# Altium schematic sheet relflow_bed.SchDoc
size A3
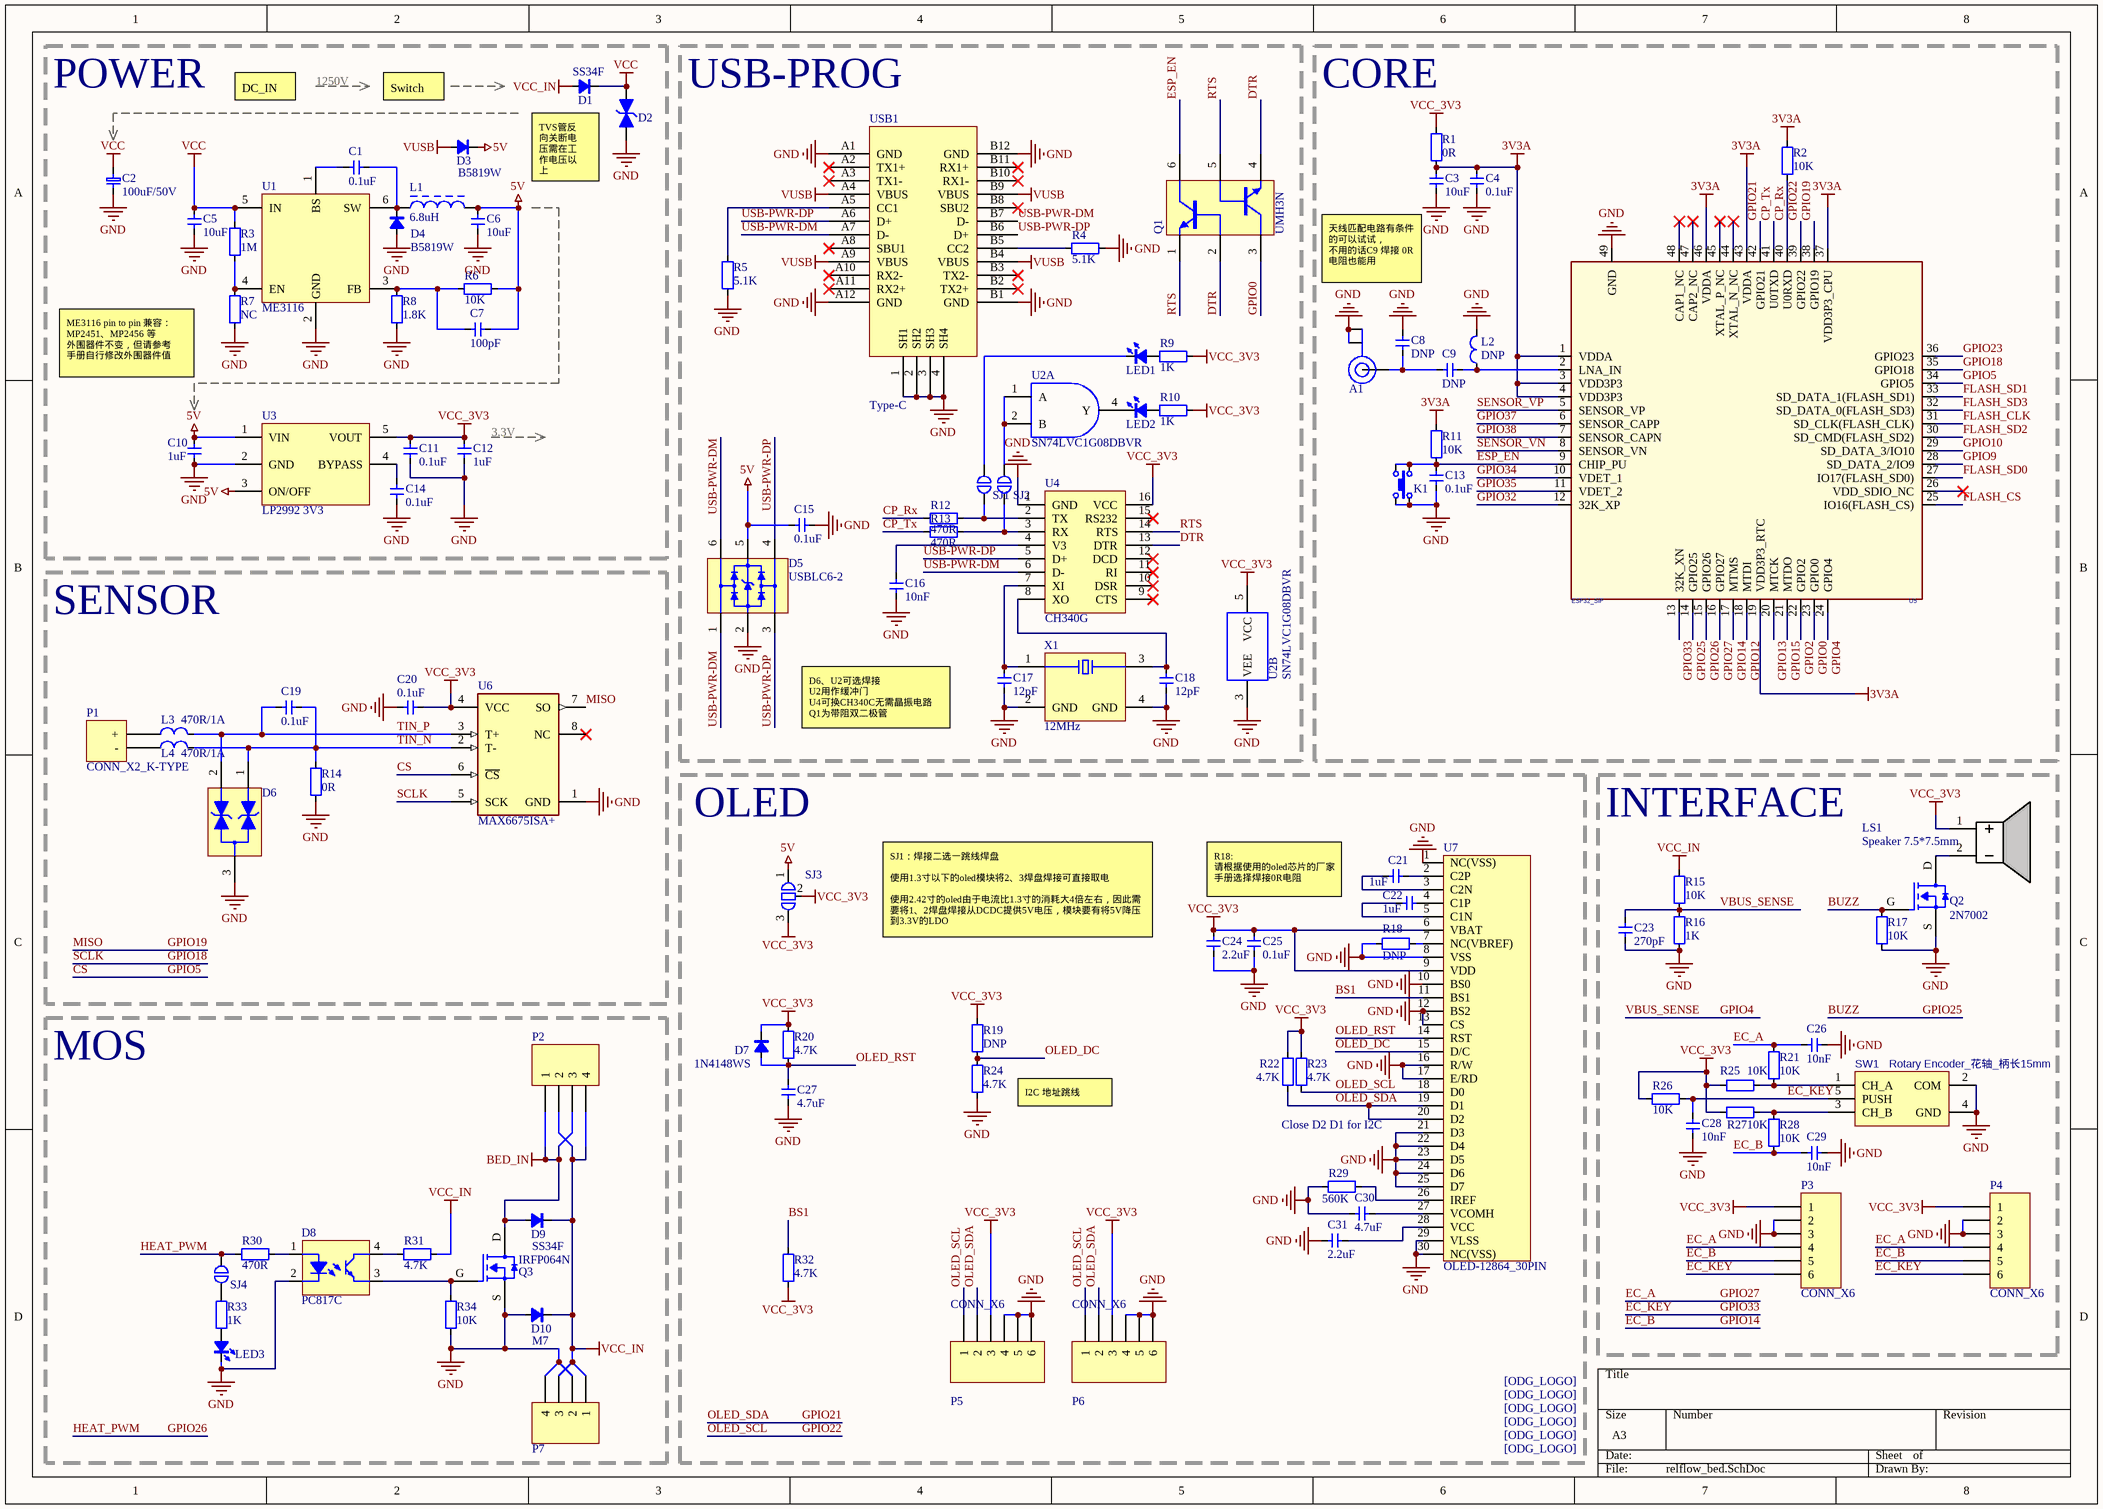
[diagram p0: relflow_bed.SchDoc]

## Parts
*1  odg_logo  [odg_logo]  (value not drawn)
*2  odg_logo  [odg_logo]  (value not drawn)
*3  odg_logo  [odg_logo]  (value not drawn)
*4  odg_logo  [odg_logo]  (value not drawn)
*5  odg_logo  [odg_logo]  (value not drawn)
*6  odg_logo  [odg_logo]  (value not drawn)
A1  ANT_IPEX  [IPEX_SMD]  (value not drawn)
C1  0.1uF  [C0603]
C2  100uF/50V  [PANASONIC_E]
C3  10uF  [C0603]
C4  0.1uF  [C0603]
C5  10uF  [C1206]
C6  10uF  [C0805]
C7  100pF  [C0603]
C8  DNP  [C0603]
C9  DNP  [C0603]
C10  1uF  [C0603]
C11  0.1uF  [C0603]
C12  1uF  [C0603]
C13  0.1uF  [C0603]
C14  0.1uF  [C0603]
C15  0.1uF  [C0603]
C16  10nF  [C0603]
C17  12pF  [C0603]
C18  12pF  [C0603]
C19  0.1uF  [C0603]
C20  0.1uF  [C0603]
C21  1uF  [C0603]
C22  1uF  [C0603]
C23  270pF  [C0603]
C24  2.2uF  [C0603]
C25  0.1uF  [C0603]
C26  10nF  [C0603]
C27  4.7uF  [C0603]
C28  10nF  [C0603]
C29  10nF  [C0603]
C30  4.7uF  [C0603]
C31  2.2uF  [C0603]
D1  SS34F  [SMAF]
D2  TVS_Bi  [DO-214AA_SMBJ]  (value not drawn)
D3  B5819W  [SOD-123]
D4  B5819W  [SOD-123]
D5  USBLC6-2  [MICROCHIP SOT-23-6 M6]
D6  NUP2105L  [INFINEON SOT-23-3]  (value not drawn)
D7  1N4148WS  [SOD-323]
D8  PC817C  [DIP-4_SMD]
D9  SS34F  [SMAF]
D10  M7  [SMAF]
K1  (no value)  [TACTILE_SWITCH_SMD_4X4MM]
L1  6.8uH  [IND-30301X]
L2  DNP  [L0603]
L3  470R/1A  [L0603]
L4  470R/1A  [L0603]
LED1  LED  [LED 0603_1608]  (value not drawn)
LED2  LED  [LED 0603_1608]  (value not drawn)
LED3  LED  [LED 0603_1608]  (value not drawn)
LS1  Speaker 7.5*7.5mm  [BUZZER_7525]
P1  CONN_X2_K-TYPE  [K型热电偶连接器母座]
P2  CONN_X4  [5569_4P_HOR_90]  (value not drawn)
P3  CONN_X6  [简易牛角座直插_2x3P]
P4  CONN_X6  [简易牛角座直插_2x3P]
P5  CONN_X6  [简易牛角座直插_2x3P]
P6  CONN_X6  [简易牛角座直插_2x3P]
P7  CONN_X4  [5566_4P_VEC]  (value not drawn)
Q1  UMH3N  [ON SEMI SOT-363]
Q2  2N7002  [INFINEON SOT-23-3]
Q3  IRFP064N  [TO-247AC+HEAT_SINK-TO220]
R1  0R  [R0603]
R2  10K  [R0603]
R3  1M  [R0603]
R4  5.1K  [R0603]
R5  5.1K  [R0603]
R6  10K  [R0603]
R7  NC  [R0603]
R8  1.8K  [R0603]
R9  1K  [R0603]
R10  1K  [R0603]
R11  10K  [R0603]
R12  470R  [R0603]
R13  470R  [R0603]
R14  0R  [R0603]
R15  10K  [R0603]
R16  1K  [R0603]
R17  10K  [R0603]
R18  DNP  [R0603]
R19  DNP  [R0603]
R20  4.7K  [R0603]
R21  10K  [R0603]
R22  4.7K  [R0603]
R23  4.7K  [R0603]
R24  4.7K  [R0603]
R25  10K  [R0603]
R26  10K  [R0603]
R27  10K  [R0603]
R28  10K  [R0603]
R29  560K  [R0603]
R30  470R  [R0603]
R31  4.7K  [R0603]
R32  4.7K  [R0603]
R33  1K  [R0603]
R34  10K  [R0603]
SJ1  SJ_2P  [SJ_2P_MINI]  (value not drawn)
SJ2  SJ_2P  [SJ_2P_MINI]  (value not drawn)
SJ3  SJ_3P  [SJ_3P]  (value not drawn)
SJ4  SJ_2P  [SJ_2P_MINI]  (value not drawn)
SW1  Rotary Encoder_花轴_柄长15mm  [ENCODER-1]
U1  ME3116  [MICROCHIP SOT-23-6 M6]
U2  SN74LVC1G08DBVR  [MICROCHIP SOT-23-5 OT]  (parts A,B of 2)
U3  LP2992 3V3  [MICROCHIP SOT-23-5 OT]
U4  CH340G  [TI SOP-16 D]
U5  ESP32_SIP  [QFN-48_7X7_via]
U6  Part Number: MAX6675ISA+  [SO-8]  (hidden comment: MAX6675ISA)
U7  OLED-12864_30PIN  [UG-2864HSWEG01_1.29_SSD1315_BUTTOM]
USB1  Type-C  [Type-C-TOP]
X1  12MHz  [EPSON TSX-3225]

## Blocks framed on the sheet
POWER: C1 C2 C5-C7 C10-C12 C14 D1-D4 L1 R3 R6-R8 U1 U3
USB-PROG: C15-C18 D5 LED1 LED2 Q1 R4 R5 R9 R10 R12 R13 SJ1 SJ2 U2 U4 USB1 X1
CORE: A1 C3 C4 C8 C9 C13 K1 L2 R1 R2 R11 U5
OLED: *1-*6 C21 C22 C24 C25 C27 C30 C31 D7 P5 P6 R18-R20 R22-R24 R29 R32 SJ3 U7
MOS: D8-D10 LED3 P2 P7 Q3 R30 R31 R33 R34 SJ4

## Nets
3V3A: C3.2 C4.2 R1.2 R2.2 R11.1 U5.1(VDDA) U5.3(VDD3P3) U5.4(VDD3P3) U5.19(VDD3P3_RTC) U5.37(VDD3P3_CPU) U5.43(VDDA) U5.46(VDDA)
5V: C6.2 C7.2 C10.2 C15.2 D3.2(C) D5.5(VBUS) L1.2 R6.1 SJ3.1 U3.1(VIN) U3.3(ON/OFF)
BED_IN: D9.1(A) P2.1 P2.3 Q3.D
GND: A1.2 A1.3 C2.2 C3.1 C4.1 C5.2 C6.1 C8.2 C10.1 C11.1 C12.1 C13.2 C14.1 C15.1 C16.1 C17.1 C18.1 C20.2 C23.1 C24.1 C25.1 C26.1 C27.1 C28.1 C29.1 C30.2 C31.2 D2.1 D4.1(A) D5.2(GND) D6.3 D8.2 D10.1(A) K1.1 K1.2 L2.2 LED3.2(K) P3.2 P3.3 P4.2 P4.3 P5.4 P5.5 P5.6 P6.4 P6.5 P6.6 P7.2 P7.4 Q2.S Q3.S R4.1 R5.2 R7.2 R8.1 R14.2 R16.2 R17.1 R18.2 R24.1 R29.1 R34.1 SW1.2(COM) SW1.4(GND) U1.2(GND) U2.3(VEE) U3.2(GND) U4.1(GND) U5.49(GND) U6.1(GND) U7.1(NC(VSS)) U7.8(VSS) U7.10(BS0) U7.12(BS2) U7.13(CS) U7.16(R/W) U7.17(E/RD) U7.21(D3) U7.22(D4) U7.23(D5) U7.24(D6) U7.25(D7) U7.29(VLSS) U7.30(NC(VSS)) USB1.1(SH1) USB1.2(SH2) USB1.3(SH3) USB1.4(SH4) USB1.A1(GND) USB1.A12(GND) USB1.B1(GND) USB1.B12(GND) X1.2(GND) X1.4(GND)
VCC: C2.1 C5.1 D1.2(C) D2.2 R3.1 U1.5(IN)
VCC_3V3: C11.2 C12.2 C20.1 C24.2 C25.2 D7.2(C) LS1.1(+) P3.1 P4.1 P5.3 P6.3 R1.1 R9.1 R10.1 R19.2 R20.2 R22.1 R23.1 R25.2 R26.2 R27.2 R32.1 SJ3.2 SJ3.3 U2.5(VCC) U3.5(VOUT) U4.16(VCC) U6.4(VCC) U7.6(VBAT) U7.9(VDD)
VCC_IN: D1.1(A) D9.2(C) D10.2(C) P2.2 P2.4 P7.1 P7.3 R15.1 R31.1
VUSB: D3.1(A) USB1.A4(VBUS) USB1.A9(VBUS) USB1.B4(VBUS) USB1.B9(VBUS)
BS1: R32.2 U7.11(BS1)
BUZZ: Q2.G R17.2 U5.14(GPIO25)  [also labelled GPIO25]
CP_Rx: R2.1 R12.1 U5.40(U0RXD)
CP_Tx: R13.1 U5.41(U0TXD)
CS: U5.34(GPIO5) U6.6(~{CS})  [also labelled GPIO5]
DTR: Q1.2(B) Q1.4(E) U4.13(DTR)
EC_A: C26.2 P3.4 P4.4 R21.1 U5.16(GPIO27)  [also labelled GPIO27]
EC_B: C29.2 P3.5 P4.5 R28.2 U5.17(MTMS)  [also labelled GPIO14]
EC_KEY: C28.2 P3.6 P4.6 R26.1 SW1.5(PUSH) U5.13(32K_XN)  [also labelled GPIO33]
ESP_EN: C13.1 K1.3 K1.4 Q1.6(C) R11.2 U5.9(CHIP_PU)
FLASH_CLK: U5.31(SD_CLK(FLASH_CLK))
FLASH_CS: U5.25(IO16(FLASH_CS))
FLASH_SD0: U5.27(IO17(FLASH_SD0))
FLASH_SD1: U5.33(SD_DATA_1(FLASH_SD1))
FLASH_SD2: U5.30(SD_CMD(FLASH_SD2))
FLASH_SD3: U5.32(SD_DATA_0(FLASH_SD3))
GPIO0: Q1.3(C) U5.23(GPIO0)
GPIO2: U5.22(GPIO2)
GPIO4: C23.2 R15.2 R16.1 U5.24(GPIO4)  [also labelled VBUS_SENSE]
GPIO9: U5.28(SD_DATA_2/IO9)
GPIO10: U5.29(SD_DATA_3/IO10)
GPIO12: U5.18(MTDI)
GPIO13: U5.20(MTCK)
GPIO15: U5.21(MTDO)
GPIO18: U5.35(GPIO18) U6.5(SCK)  [also labelled SCLK]
GPIO19: U5.38(GPIO19) U6.7(SO)  [also labelled MISO]
GPIO21: P5.2 P6.2 R22.2 U5.42(GPIO21) U7.19(D1) U7.20(D2)  [also labelled OLED_SDA]
GPIO22: P5.1 P6.1 R23.2 U5.39(GPIO22) U7.18(D0)  [also labelled OLED_SCL]
GPIO23: U5.36(GPIO23)
GPIO26: R30.2 SJ4.1 U5.15(GPIO26)  [also labelled HEAT_PWM]
GPIO32: U5.12(32K_XP)
GPIO34: U5.10(VDET_1)
GPIO35: U5.11(VDET_2)
GPIO37: U5.6(SENSOR_CAPP)
GPIO38: U5.7(SENSOR_CAPN)
OLED_DC: R19.1 R24.2 U7.15(D/C)
OLED_RST: C27.2 D7.1(A) R20.1 U7.14(RST)
RTS: Q1.1(E) Q1.5(B) U4.14(RTS)
SENSOR_VN: U5.8(SENSOR_VN)
SENSOR_VP: U5.5(SENSOR_VP)
TIN_N: C19.1 D6.1 L4.2 R14.1 U6.2(T-)
TIN_P: C19.2 D6.2 L3.2 U6.3(T+)
USB-PWR-DM: D5.1(I/O1) D5.6(I/O1) U4.6(D-) USB1.A7(D-) USB1.B7(D-)
USB-PWR-DP: D5.3(I/O2) D5.4(I/O2) U4.5(D+) USB1.A6(D+) USB1.B6(D+)
NetA1_1: A1.1 C8.1 C9.1
NetC1_1: C1.1 D4.2(C) L1.1 U1.6(SW)
NetC1_2: C1.2 U1.1(BS)
NetC7_1: C7.1 R6.2 R8.2 U1.3(FB)
NetC9_2: C9.2 L2.1 U5.2(LNA_IN)
NetC14_2: C14.2 U3.4(BYPASS)
NetC16_2: C16.2 U4.4(V3)
NetC17_2: C17.2 U4.7(XI) X1.1
NetC18_2: C18.2 U4.8(XO) X1.3
NetC21_1: C21.1 U7.2(C2P)
NetC21_2: C21.2 U7.3(C2N)
NetC22_1: C22.1 U7.4(C1P)
NetC22_2: C22.2 U7.5(C1N)
NetC30_1: C30.1 U7.27(VCOMH)
NetC31_1: C31.1 U7.28(VCC)
NetD8_1: D8.1 R30.1
NetD8_3: D8.3 Q3.G R34.2
NetD8_4: D8.4 R31.2
NetL3_1: L3.1 P1.+
NetL4_1: L4.1 P1.-
NetLED1_1: LED1.1(A) R9.2
NetLED1_2: LED1.2(K) SJ1.1
NetLED2_1: LED2.1(A) R10.2
NetLED2_2: LED2.2(K) U2.4(Y)
NetLED3_1: LED3.1(A) R33.2
NetLS1_2: LS1.2(-) Q2.D
NetR3_2: R3.2 R7.1 U1.4(EN)
NetR4_2: R4.2 USB1.B5(CC2)
NetR5_1: R5.1 USB1.A5(CC1)
NetR12_2: R12.2 SJ1.2 U4.2(TX)
NetR13_2: R13.2 SJ2.2 U4.3(RX)
NetR18_1: R18.1 U7.7(NC(VBREF))
NetR21_2: R21.2 R25.1 SW1.1(CH_A)
NetR27_1: R27.1 R28.1 SW1.3(CH_B)
NetR29_2: R29.2 U7.26(IREF)
NetR33_1: R33.1 SJ4.2
NetSJ2_1: SJ2.1 U2.1(A) U2.2(B)

Not connected (* = marked no-connect by the designer): U4 9(CTS)* 10(DSR)* 11(RI)* 12(DCD)* 15(RS232)*; U5 26(VDD_SDIO_NC)* 44(XTAL_N_NC)* 45(XTAL_P_NC)* 47(CAP2_NC)* 48(CAP1_NC)*; U6 8(NC)*; USB1 A2(TX1+)* A3(TX1-)* A8(SBU1)* A10(RX2-)* A11(RX2+)* B2(TX2+)* B3(TX2-)* B8(SBU2)* B10(RX1-)* B11(RX1+)*

## Notes on the sheet
- DC_IN
- 1250V
- Switch
- TVS管反
  向关断电
  压需在工
  作电压以
  上
- 天线匹配电路有条件的可以试试，
  不用的话C9 焊接 0R电阻也能用
- (near R7) ME3116 pin to pin 兼容：
  MP2451、MP2456 等
  外围器件不变，但请参考
  手册自行修改外围器件值
- (near C12) 3.3V
- SENSOR
- D6、U2可选焊接
  U2用作缓冲门
  U4可换CH340C无需晶振电路
  Q1为带阻双二极管
- (near R15) INTERFACE
- R18:
  请根据使用的oled芯片的厂家手册选择焊接0R电阻
- SJ1：焊接二选一跳线焊盘
  使用1.3寸以下的oled模块将2、3焊盘焊接可直接取电
  使用2.42寸的oled由于电流比1.3寸的消耗大4倍左右，因此需要将1、2焊盘焊接从DCDC提供5V电压，模块要有将5V降压到3.3V的LDO
- I2C 地址跳线
- Close D2 D1 for I2C
- (in symbol odg_logo) [ODG_LOGO]

## Library data of the parts
C1 C3-C31 = CAP: Capacitor
C2 = CAP_Polar: Capacitor
D1 D3 D4 D7 D9 D10 = DIODE
D5 = USBLC6-2: Very low capacitance ESD protection
D8 = Optoisolator
K1 = ButtonTACT: Button
L1 = Inductor
L2-L4 = FUSE
LED1-LED3 = LED: Value: color?
LS1 = Speaker
Q1 = UMH3N: NPN型带阻双三极管 / NPN+NPN, SOT-363, Dual Digital Transistor (Bias Resistor Built-in Transistor); ComponentLink1Description: Datasheet; ComponentLink1URL: https://fscdn.rohm.com/en/products/databook/datasheet/discrete/transistor/digital/umh3ntn-e.pdf
Q2 Q3 = N-MOS
R1-R34 = RES: Resistor
SW1 = Rotary Encoder
U1 = ME3116: DC-DC
U2 = SN74LVC1G08DBVR: Single 2-input AND gate / 1.8~3.3V logic
U3 = LP2992: LDO
U4 = CH340G: 丐中丐，需要外接12M晶振
U5 = ESP32-PICO
U6 = MAX6675ISA: IC THERMOCOUP TO DGTL 8-SOIC; Manufacturer: Maxim Electronics; Category 9E07530Daf1645C0: Semiconductors and Actives; Category 3Cb8F1B20D37E77F: Sensors (Acceleration, Pressure, ...); Category 8A76477Cb9Bd51B1: Temperature Control and Regulation; Category 84F649Fcb0Ed5F31: Uncategorized; max_supply_voltage_dc: 5.50V; Category D46C1966E09E0Fab: Temperature; Category Db391633E8F300Fe: Industrial Control; Category C33B0E31F09B18Fc: Temperature Sensor ICs; Mfg Package Ident: 21-0041; Category E95E2454Daf93299: Temperature Sensing/Measurement; Category 2Fc5E2Cf1B85F402: Interface ICs; Category 6B95A69F5F75B052: Sensors and Accessories; Symbol 0 0: Standard; Num Pins: 8; supply_current: 0.70 mA; helpURL: https://upverter.com/upn/revision/df8f98e99e77f28c/; ComponentLink2Description: Datasheet; Temperature: -20°C to +85°C; Package: 21-0041; Supplier 2: Mouser; Supplier 1: Digi-Key; ComponentLink1URL: https://upverter.com/upn/revision/df8f98e99e77f28c/; Supplier Part Number 2: 700-MAX6675ISA; Supplier Part Number 1: MAX6675ISA+-ND; ComponentLink1Description: Upverter; ComponentLink2URL: https://upverter.com/datasheet/328f41e80cd5fba93d602566d8324382201f26da.pdf; RoHS: TRUE; Temperature Range High: +85°C; Octopart Part Number: 33bcfab92ad8ec7b; Digikey Description: IC THERMOCOUP TO DGTL 8-SOIC; Digikey Part Number: MAX6675ISA+-ND; Lead Free: yes; Type: integrated circuit; Category 20B3Edb914A9Fb74: Uncategorized; Mouser Part Number: 700-MAX6675ISA; Temperature Range Low: -20°C; Category 3B3Df6370Ab4E0Fa: Temperature Sensor ICs; Mounting Type: surface mount; Ipc Land Pattern Name: SOIC127P600X155-8
U7 = OLED-12864_30PIN: 显示屏
USB1 = USB-Type-C-24P
X1 = XTAL-4P: 4脚无源晶振